# Altium project PDM-C.PrjPcb
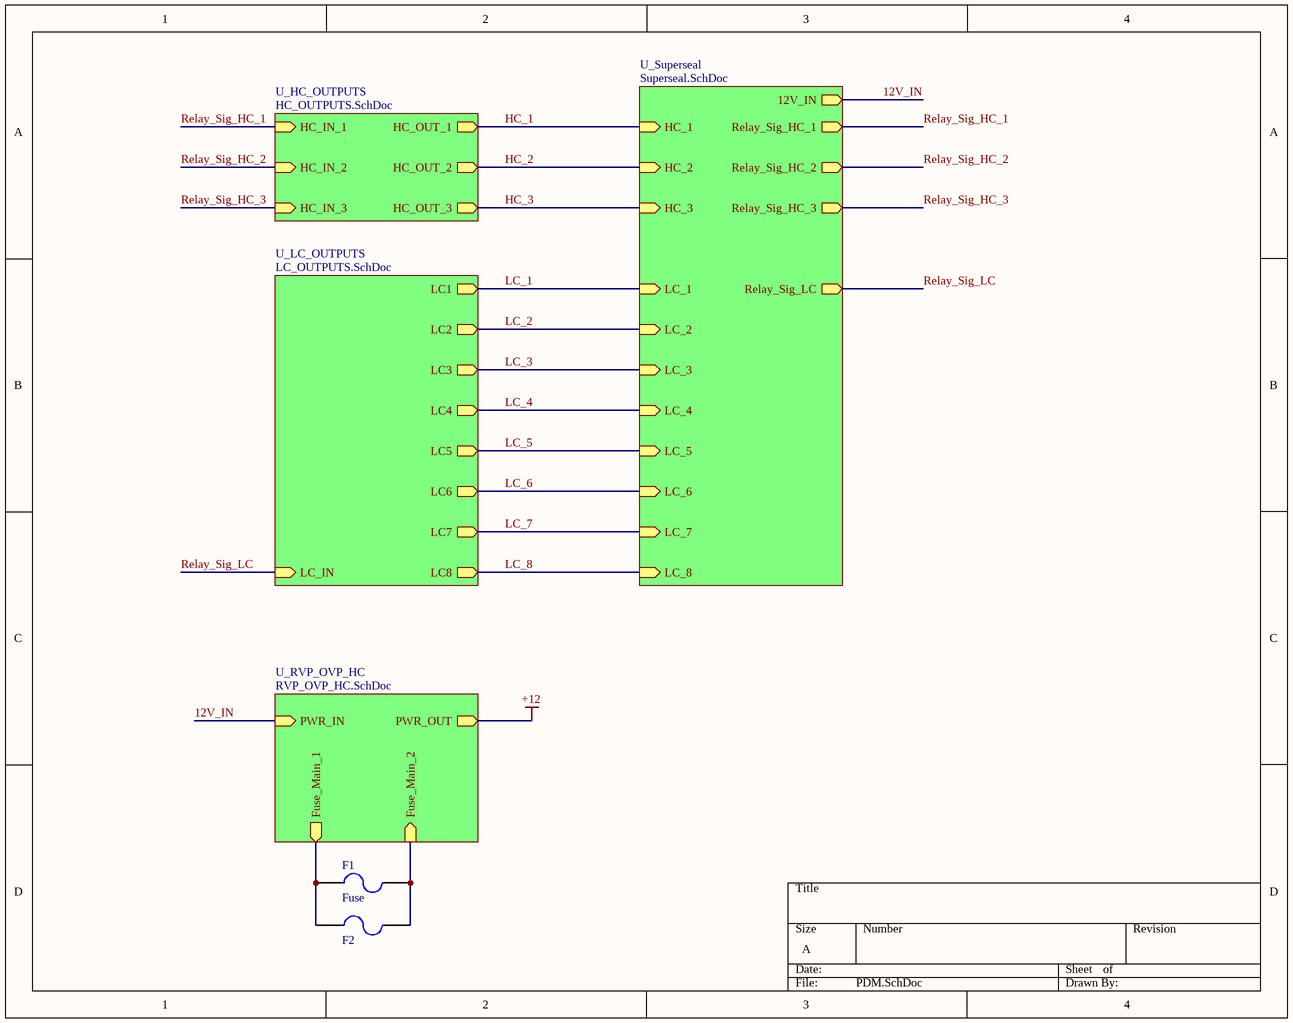
[diagram p0: PDM.SchDoc]
6 sheets, 98 parts. Net scope: hierarchical (ports join the sheet entries above them; power ports are global).
Board files: PDM-C_Board.PcbDoc, PDM-C_Rev2.PcbDoc
Sheets:
  PDM.SchDoc
    U_LC_OUTPUTS = LC_OUTPUTS.SchDoc
      U_Blown_Fuse_LED = Blown_Fuse_LED.SchDoc
      U_Relay = Relay.SchDoc
      U_Blown_Fuse_LED = Blown_Fuse_LED.SchDoc
      U_Blown_Fuse_LED = Blown_Fuse_LED.SchDoc
      U_Blown_Fuse_LED = Blown_Fuse_LED.SchDoc
      U_Blown_Fuse_LED = Blown_Fuse_LED.SchDoc
      U_Blown_Fuse_LED = Blown_Fuse_LED.SchDoc
      U_Blown_Fuse_LED = Blown_Fuse_LED.SchDoc
      U_Blown_Fuse_LED = Blown_Fuse_LED.SchDoc
    U_HC_OUTPUTS = HC_OUTPUTS.SchDoc
      U_Blown_Fuse_LED = Blown_Fuse_LED.SchDoc
      U_Relay = Relay.SchDoc
      U_Blown_Fuse_LED = Blown_Fuse_LED.SchDoc
      U_Relay = Relay.SchDoc
      U_Blown_Fuse_LED = Blown_Fuse_LED.SchDoc
      U_Relay = Relay.SchDoc
    U_Superseal = Superseal.SchDoc

## Sheet PDM.SchDoc
size A

### Parts
F1  Fuse  [3568-MiniFuseHolder]
F2  Fuse  [3568-MiniFuseHolder]  (value not drawn)

### Sub-sheets
U_HC_OUTPUTS = HC_OUTPUTS.SchDoc: HC_IN_1 (in), HC_OUT_1 (out), HC_IN_2 (in), HC_OUT_2 (out), HC_IN_3 (in), HC_OUT_3 (out)
U_LC_OUTPUTS = LC_OUTPUTS.SchDoc: LC8 (out), LC1 (out), LC2 (out), LC3 (out), LC4 (out), LC5 (out), LC6 (out), LC7 (out), LC_IN (in)
U_RVP_OVP_HC = RVP_OVP_HC.SchDoc (file not in this document): PWR_IN (in), PWR_OUT (out), Fuse_Main_1 (out), Fuse_Main_2 (in)
U_Superseal = Superseal.SchDoc: 12V_IN (out), Relay_Sig_LC (out), Relay_Sig_HC_1 (out), Relay_Sig_HC_2 (out), HC_1 (in), HC_2 (in), LC_1 (in), LC_2 (in), LC_3 (in), LC_4 (in), LC_5 (in), LC_6 (in), LC_7 (in), LC_8 (in), Relay_Sig_HC_3 (out), HC_3 (in)

### Nets
12V_IN: sheet U_RVP_OVP_HC/PWR_IN, sheet U_Superseal/12V_IN
HC_1: sheet U_HC_OUTPUTS/HC_OUT_1, sheet U_Superseal/HC_1
HC_2: sheet U_HC_OUTPUTS/HC_OUT_2, sheet U_Superseal/HC_2
HC_3: sheet U_HC_OUTPUTS/HC_OUT_3, sheet U_Superseal/HC_3
LC_1: sheet U_LC_OUTPUTS/LC1, sheet U_Superseal/LC_1
LC_2: sheet U_LC_OUTPUTS/LC2, sheet U_Superseal/LC_2
LC_3: sheet U_LC_OUTPUTS/LC3, sheet U_Superseal/LC_3
LC_4: sheet U_LC_OUTPUTS/LC4, sheet U_Superseal/LC_4
LC_5: sheet U_LC_OUTPUTS/LC5, sheet U_Superseal/LC_5
LC_6: sheet U_LC_OUTPUTS/LC6, sheet U_Superseal/LC_6
LC_7: sheet U_LC_OUTPUTS/LC7, sheet U_Superseal/LC_7
LC_8: sheet U_LC_OUTPUTS/LC8, sheet U_Superseal/LC_8
Relay_Sig_HC_1: sheet U_HC_OUTPUTS/HC_IN_1, sheet U_Superseal/Relay_Sig_HC_1
Relay_Sig_HC_2: sheet U_HC_OUTPUTS/HC_IN_2, sheet U_Superseal/Relay_Sig_HC_2
Relay_Sig_HC_3: sheet U_HC_OUTPUTS/HC_IN_3, sheet U_Superseal/Relay_Sig_HC_3
Relay_Sig_LC: sheet U_LC_OUTPUTS/LC_IN, sheet U_Superseal/Relay_Sig_LC
NetF1_1: F1.1 F2.1 ; sheet U_RVP_OVP_HC/Fuse_Main_1
NetF1_2: F1.2 F2.2 ; sheet U_RVP_OVP_HC/Fuse_Main_2

### Library data of the parts
F1 F2 = 3: Manufacturer_id: 1; idFuse: 3; Name: 3568 Mini Fuse Holder; Drawer_id: 1
  F2: Link: https://www.digikey.com/product-detail/en/keystone-electronics/3568/36-3568-ND/2137306

## Sheet LC_OUTPUTS.SchDoc
size A
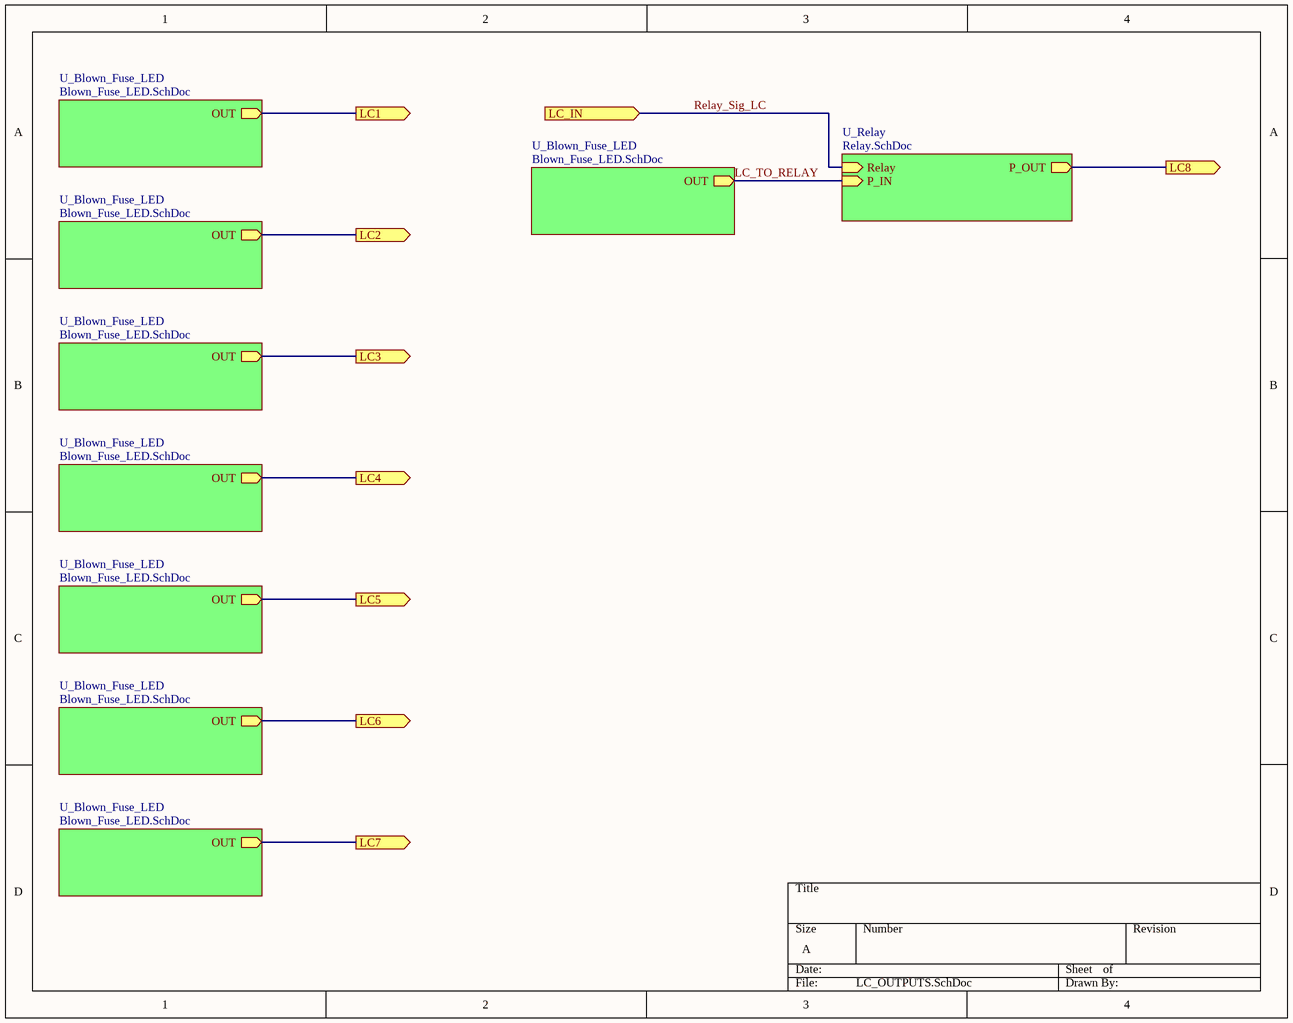
[diagram p1: LC_OUTPUTS.SchDoc]

### Sub-sheets
U_Blown_Fuse_LED = Blown_Fuse_LED.SchDoc: OUT (out)
U_Blown_Fuse_LED = Blown_Fuse_LED.SchDoc: OUT (out)
U_Blown_Fuse_LED = Blown_Fuse_LED.SchDoc: OUT (out)
U_Blown_Fuse_LED = Blown_Fuse_LED.SchDoc: OUT (out)
U_Blown_Fuse_LED = Blown_Fuse_LED.SchDoc: OUT (out)
U_Blown_Fuse_LED = Blown_Fuse_LED.SchDoc: OUT (out)
U_Blown_Fuse_LED = Blown_Fuse_LED.SchDoc: OUT (out)
U_Blown_Fuse_LED = Blown_Fuse_LED.SchDoc: OUT (out)
U_Relay = Relay.SchDoc: Relay (in), P_OUT (out), P_IN (in)

### Ports
LC1 (out), LC2 (out), LC3 (out), LC4 (out), LC5 (out), LC6 (out), LC7 (out), LC8 (out), LC_IN (in)

### Nets
LC_1: port LC1, sheet U_Blown_Fuse_LED/OUT
LC_2: port LC2, sheet U_Blown_Fuse_LED/OUT
LC_3: port LC3, sheet U_Blown_Fuse_LED/OUT
LC_4: port LC4, sheet U_Blown_Fuse_LED/OUT
LC_5: port LC5, sheet U_Blown_Fuse_LED/OUT
LC_6: port LC6, sheet U_Blown_Fuse_LED/OUT
LC_7: port LC7, sheet U_Blown_Fuse_LED/OUT
LC_8: port LC8, sheet U_Relay/P_OUT
LC_TO_RELAY: sheet U_Blown_Fuse_LED/OUT, sheet U_Relay/P_IN
Relay_Sig_LC: port LC_IN, sheet U_Relay/Relay

## Sheet Blown_Fuse_LED.SchDoc
size A
Used 11 times, as channels U_LC_OUTPUTS/U_Blown_Fuse_LED, U_LC_OUTPUTS/U_Blown_Fuse_LED, U_LC_OUTPUTS/U_Blown_Fuse_LED, U_LC_OUTPUTS/U_Blown_Fuse_LED, U_LC_OUTPUTS/U_Blown_Fuse_LED, U_LC_OUTPUTS/U_Blown_Fuse_LED, U_LC_OUTPUTS/U_Blown_Fuse_LED, U_LC_OUTPUTS/U_Blown_Fuse_LED, U_HC_OUTPUTS/U_Blown_Fuse_LED, U_HC_OUTPUTS/U_Blown_Fuse_LED, U_HC_OUTPUTS/U_Blown_Fuse_LED. Parts and nets are listed once, with the designators drawn on the sheet.
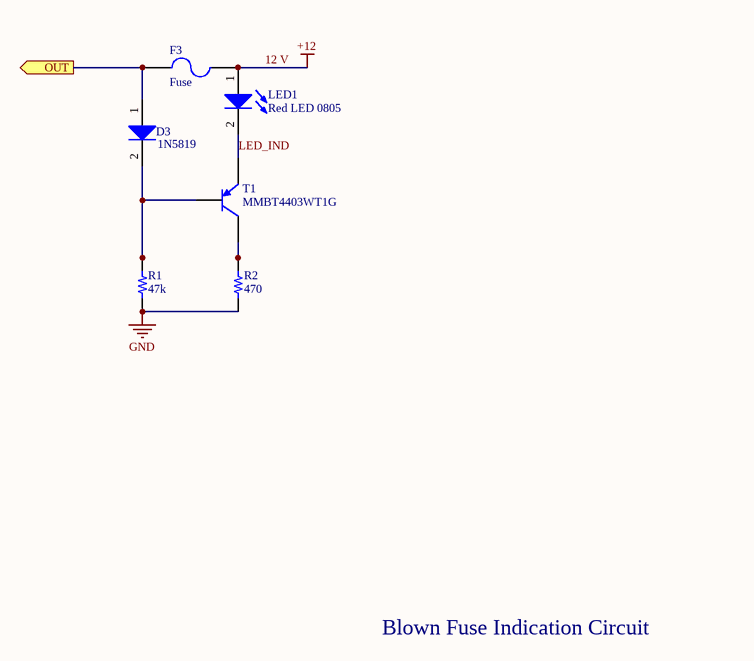
[diagram p2: Blown_Fuse_LED.SchDoc]

### Parts
D3  1N5819  [SOD123F]
F3  Fuse  [3568-MiniFuseHolder]
LED1  Red LED 0805  [0805_LED]
R1  value 47k  [RES 0805/2012]  (hidden comment: Resistor 47k 0805 1/10W 1%)
R2  value 470  [RES 0805/2012]  (hidden comment: Resistor 470 0805 1/10W 1%)
T1  MMBT4403WT1G  [SOT23-3]

### Ports
OUT (out)

### Nets
12 V: F3.2 LED1.1(A)  [also labelled +12]
GND: R1.2 R2.2
LED_IND: LED1.2(K) T1.2(E)
OUT: D3.1(A) F3.1 ; port OUT
NetD3_2: D3.2(K) R1.1 T1.1(B)
NetR2_1: R2.1 T1.3(C)

### Channels
U_LC_OUTPUTS/U_Blown_Fuse_LED: designators D3=D14 F3=F8 LED1=LED8 R1=R16 R2=R17 T1=T5; ports OUT=LC_TO_RELAY
U_LC_OUTPUTS/U_Blown_Fuse_LED: designators D3=D15 F3=F10 LED1=LED9 R1=R18 R2=R19 T1=T4; ports OUT=LC_1
U_LC_OUTPUTS/U_Blown_Fuse_LED: designators D3=D16 F3=F12 LED1=LED11 R1=R20 R2=R22 T1=T3; ports OUT=LC_2
U_LC_OUTPUTS/U_Blown_Fuse_LED: designators D3=D17 F3=F13 LED1=LED12 R1=R23 R2=R24 T1=T2; ports OUT=LC_3
U_LC_OUTPUTS/U_Blown_Fuse_LED: designators D3=D8 F3=F6 LED1=LED4 R1=R8 R2=R9 T1=T9; ports OUT=LC_4
U_LC_OUTPUTS/U_Blown_Fuse_LED: designators D3=D10 F3=F7 LED1=LED5 R1=R10 R2=R11 T1=T8; ports OUT=LC_5
U_LC_OUTPUTS/U_Blown_Fuse_LED: designators D3=D11 F3=F9 LED1=LED6 R1=R12 R2=R13 T1=T7; ports OUT=LC_6
U_LC_OUTPUTS/U_Blown_Fuse_LED: designators D3=D13 F3=F11 LED1=LED7 R1=R14 R2=R15 T1=T6; ports OUT=LC_7
U_HC_OUTPUTS/U_Blown_Fuse_LED: designators D3=D5 F3=F5 LED1=LED3 R1=R6 R2=R7 T1=T10; ports OUT=HC1_TO_RELAY
U_HC_OUTPUTS/U_Blown_Fuse_LED: designators D3=D1 F3=F3 LED1=LED1 R1=R1 R2=R2 T1=T12; ports OUT=HC2_TO_RELAY
U_HC_OUTPUTS/U_Blown_Fuse_LED: designators D3=D2 F3=F4 LED1=LED2 R1=R3 R2=R4 T1=T11; ports OUT=HC3_TO_RELAY

### Notes on the sheet
- Blown Fuse Indication Circuit

### Library data of the parts
D3 = 2: Diode Super Barrier 40V 1A Surface Mount SOD-123F; Manufacturer_id: 1; MfrPartNo: 1N5819HW1-7-F; idDiode: 2; Drawer_id: 1; Name: 1N5819; Value: 1A; Type: Super Barrier; Num_Circuits: 1; Ic: 1A; Power: 40V; Package: SOD-123; Link: https://www.digikey.com/product-detail/en/diodes-incorporated/1N5819HW1-7-F/1N5819HW1-7-FDITR-ND/5768523; ComponentLink1Description: Datasheet; ComponentLink1URL: https://www.diodes.com/assets/Datasheets/1N5819HW1.pdf; Supplier1: Digi-Key; Supplier1PartNo: 1N5819HW1-7-FDITR-ND
F3 = 3: as F1 on sheet PDM; Drawer_id: 1
LED1 = 1: idLED: 1; Name: LED_0805_RED; Vf: 0.7V; Manufacturer_id: 1; Drawer_id: 1; Value: Red; Package: 0805
R1 = 545: Manufacturer_id: 1; idResistor: 545; Name: Res_47k_0805_1/10W_1%; Created_By: Nick Mah; Supplier 1: Digi-Key; Drawer_id: 1; Tolerance: 1%; Power: 1/10W; Package: 0805; ComponentLink1Description: Datasheet; Created_Date: 2018-10-20
R2 = 497: Manufacturer_id: 1; idResistor: 497; Name: Res_470_0805_1/10W_1%; Created_By: Nick Mah; Supplier 1: Digi-Key; Drawer_id: 1; Tolerance: 1%; Power: 1/10W; Package: 0805; ComponentLink1Description: Datasheet; Created_Date: 2018-10-20
T1 = 3: Manufacturer_id: 1; idBJT: 3; Type: PNP; Ic: 600mA; Vce(Max): -40V; Created_By: Angel; Drawer_id: 1; Name: MMBT4403WT1G; Num_Circuits: 1; Package: SOT23-3; MfrPartNo: MMBT4403WT1G; Link: https://www.digikey.com/product-detail/en/on-semiconductor/MMBT4403WT1G/MMBT4403WT1GOSCT-ND/3487572

## Sheet Relay.SchDoc
size A
Used 4 times, as channels U_LC_OUTPUTS/U_Relay, U_HC_OUTPUTS/U_Relay, U_HC_OUTPUTS/U_Relay, U_HC_OUTPUTS/U_Relay. Parts and nets are listed once, with the designators drawn on the sheet.
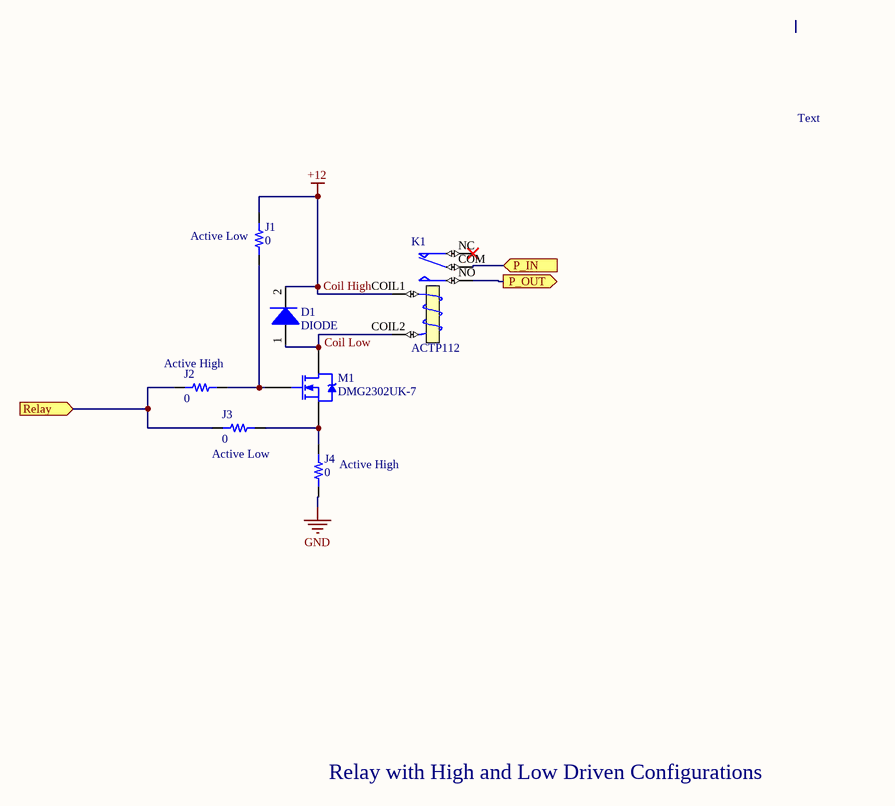
[diagram p3: Relay.SchDoc]

### Parts
D1  DIODE  [SOD123F]
J1  value 0  [RES 0603/1608]  (hidden comment: Resistor 1.0 0603 1/10W 10%)
J2  value 0  [RES 0603/1608]  (hidden comment: Resistor 1.0 0603 1/10W 10%)
J3  value 0  [RES 0603/1608]  (hidden comment: Resistor 1.0 0603 1/10W 10%)
J4  value 0  [RES 0603/1608]  (hidden comment: Resistor 1.0 0603 1/10W 10%)
K1  ACTP112  [ACTP112]
M1  DMG2302UK-7  [SOT23-3]

### Ports
P_IN (in), P_OUT (out), Relay (in)

### Nets
Coil High: D1.2(K) J1.2 K1.COIL1(T1)  [also labelled +12]
GND: J4.2
P_IN: K1.COM ; port P_IN
P_OUT: K1.NO ; port P_OUT
Relay: J2.2 J3.1 ; port Relay
NetD1_1: D1.1(A) K1.COIL2(T2) M1.3(D)
NetJ1_1: J1.1 J2.1 M1.1(G)
NetJ3_2: J3.2 J4.1 M1.2(S)

Not connected (* = marked no-connect by the designer): K1 NC*

### Channels
U_LC_OUTPUTS/U_Relay: designators D1=D12 J1=J3 J2=J1#1 J3=J4 J4=J2 K1=K4 M1=M1; ports P_IN=LC_TO_RELAY P_OUT=LC_8 Relay=Relay_Sig_LC
U_HC_OUTPUTS/U_Relay: designators D1=D9 J1=J9 J2=J5 J3=J10 J4=J6 K1=K3 M1=M2; ports P_IN=HC1_TO_RELAY P_OUT=HC_1 Relay=Relay_Sig_HC_1
U_HC_OUTPUTS/U_Relay: designators D1=D3 J1=J16 J2=J14 J3=J17 J4=J15 K1=K1 M1=M4; ports P_IN=HC2_TO_RELAY P_OUT=HC_2 Relay=Relay_Sig_HC_2
U_HC_OUTPUTS/U_Relay: designators D1=D6 J1=J8 J2=J13 J3=J7 J4=J11 K1=K2 M1=M3; ports P_IN=HC3_TO_RELAY P_OUT=HC_3 Relay=Relay_Sig_HC_3

### Notes on the sheet
- Text
- (near J1) Active Low
- (near J2) Active High
- (near J3) Active Low
- (near J4) Active High
- Relay with High and Low Driven Configurations
- Labels drawn without touching a wire or pin: Coil Low

### Library data of the parts
D1 = 2: Diode Super Barrier 40V 1A Surface Mount SOD-123F; Manufacturer_id: 1; MfrPartNo: 1N5819HW1-7-F; idDiode: 2; Name: 1N5819; Drawer_id: 1; Value: 1A; Type: Super Barrier; Num_Circuits: 1; Ic: 1A; Power: 40V; Package: SOD-123; Link: https://www.digikey.com/product-detail/en/diodes-incorporated/1N5819HW1-7-F/1N5819HW1-7-FDITR-ND/5768523; ComponentLink1Description: Datasheet; ComponentLink1URL: https://www.diodes.com/assets/Datasheets/1N5819HW1.pdf; Supplier1: Digi-Key; Supplier1PartNo: 1N5819HW1-7-FDITR-ND
J1-J4 = 2269: Manufacturer_id: 1; idResistor: 2269; Name: Res_1.0_0603_1/10W_10%; Created_By: Nick Mah; Supplier 1: Digi-Key; Drawer_id: 1; Tolerance: 10%; Power: 1/10W; Package: 0603; ComponentLink1Description: Datasheet; Created_Date: 2018-10-20
K1 = 3: Manufacturer_id: 1; idRelay: 3; Coil_Voltage: 12V; Published: 8-Jun-2000; LatestRevisionDate: 17-Jul-2002; LatestRevisionNote: Re-released for DXP Platform.; PackageReference: MODULE5B; Publisher: Altium Limited; Drawer_id: 1; Name: ACTP112
M1 = 6: MOSFET N-CHANNEL 30V 5A SOT23; Manufacturer_id: 1; idFETs: 6; Value: N_Channel; Vdss: 20V; Id: 2.8A; Rds_On: 90mOhm; Vgs(typ): 800mV; Vgs(Max): 1V; Created_By: Angel; MfrPartNo: DMG2302UK-7; Drawer_id: 1; Name: DMG2302UK-7; Num_Circuits: 1; Package: SOT-23; Link: https://www.digikey.com/product-detail/en/diodes-incorporated/DMG2302UK-7/DMG2302UK-7DICT-ND/6010163; Supplier1: Digi-Key

## Sheet HC_OUTPUTS.SchDoc
size A
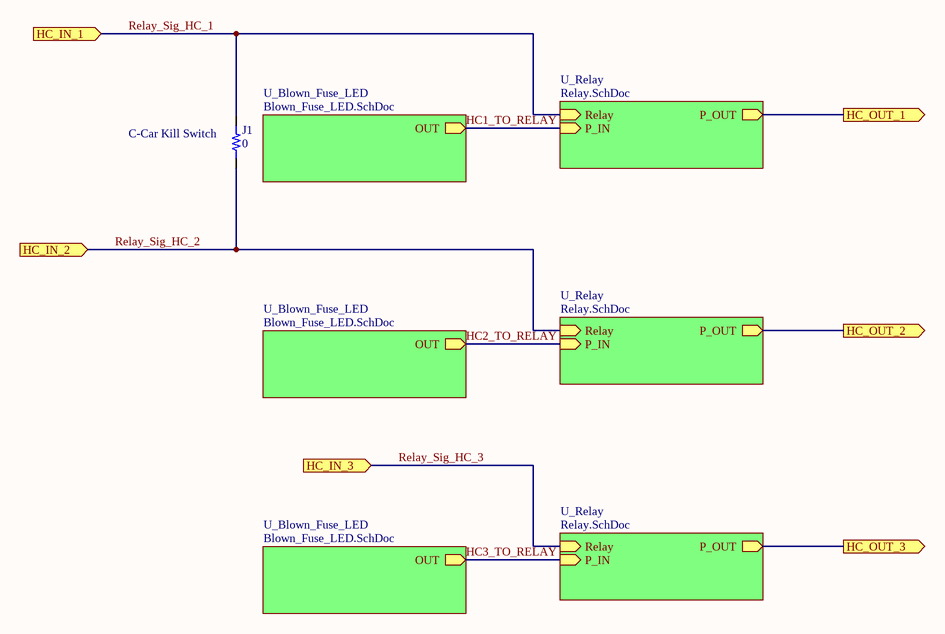
[diagram p4: HC_OUTPUTS.SchDoc]

### Parts
(Parts that share a designator on the sheet are numbered #1, #2 ... from top to bottom, then left to right.)
J1#2  value 0  [RES 0603/1608]  (hidden comment: Resistor 1.0 0603 1/10W 10%)

### Sub-sheets
U_Blown_Fuse_LED = Blown_Fuse_LED.SchDoc: OUT (out)
U_Blown_Fuse_LED = Blown_Fuse_LED.SchDoc: OUT (out)
U_Blown_Fuse_LED = Blown_Fuse_LED.SchDoc: OUT (out)
U_Relay = Relay.SchDoc: Relay (in), P_OUT (out), P_IN (in)
U_Relay = Relay.SchDoc: Relay (in), P_OUT (out), P_IN (in)
U_Relay = Relay.SchDoc: Relay (in), P_OUT (out), P_IN (in)

### Ports
HC_IN_1 (in), HC_IN_2 (in), HC_IN_3 (in), HC_OUT_1 (out), HC_OUT_2 (out), HC_OUT_3 (out)

### Nets
HC1_TO_RELAY: sheet U_Blown_Fuse_LED/OUT, sheet U_Relay/P_IN
HC2_TO_RELAY: sheet U_Blown_Fuse_LED/OUT, sheet U_Relay/P_IN
HC3_TO_RELAY: sheet U_Blown_Fuse_LED/OUT, sheet U_Relay/P_IN
HC_1: port HC_OUT_1, sheet U_Relay/P_OUT
HC_2: port HC_OUT_2, sheet U_Relay/P_OUT
HC_3: port HC_OUT_3, sheet U_Relay/P_OUT
Relay_Sig_HC_1: J1#2.1 ; port HC_IN_1, sheet U_Relay/Relay
Relay_Sig_HC_2: J1#2.2 ; port HC_IN_2, sheet U_Relay/Relay
Relay_Sig_HC_3: port HC_IN_3, sheet U_Relay/Relay

### Notes on the sheet
- (near J1#2) C-Car Kill Switch

### Library data of the parts
J1#2 = 2269: as J1 on sheet Relay; Supplier 1: Digi-Key; Drawer_id: 1; Tolerance: 10%; Power: 1/10W; Package: 0603; ComponentLink1Description: Datasheet; Created_Date: 2018-10-20

## Sheet Superseal.SchDoc
size A
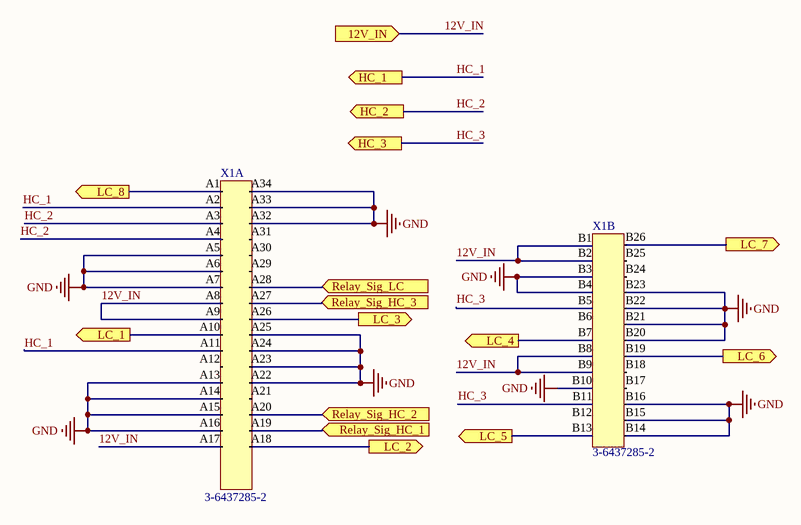
[diagram p5: Superseal.SchDoc]

### Parts
X1  3-6437285-2  [SUPERSEAL 60POS 90Deg]  (parts A,B of 2)

### Ports
12V_IN (in), HC_1 (out), HC_2 (out), HC_3 (out), LC_1 (out), LC_2 (out), LC_3 (out), LC_4 (out), LC_5 (out), LC_6 (out), LC_7 (out), LC_8 (out), Relay_Sig_HC_1 (in), Relay_Sig_HC_2 (in), Relay_Sig_HC_3 (in), Relay_Sig_LC (in)

### Nets
GND: X1.A5 X1.A6 X1.A7 X1.A13 X1.A14 X1.A15 X1.A16 X1.A22 X1.A23 X1.A24 X1.A25 X1.A32 X1.A33 X1.A34 X1.B3 X1.B4 X1.B10 X1.B14 X1.B15 X1.B16 X1.B20 X1.B21 X1.B22 X1.B23
12V_IN: X1.A8 X1.A9 X1.A17 X1.B1 X1.B2 X1.B8 X1.B9 ; port 12V_IN
HC_1: X1.A2 X1.A11 ; port HC_1
HC_2: X1.A3 X1.A4 ; port HC_2
HC_3: X1.B5 X1.B11 ; port HC_3
LC_1: X1.A10 ; port LC_1
LC_2: X1.A18 ; port LC_2
LC_3: X1.A26 ; port LC_3
LC_4: X1.B7 ; port LC_4
LC_5: X1.B13 ; port LC_5
LC_6: X1.B19 ; port LC_6
LC_7: X1.B26 ; port LC_7
LC_8: X1.A1 ; port LC_8
Relay_Sig_HC_1: X1.A19 ; port Relay_Sig_HC_1
Relay_Sig_HC_2: X1.A20 ; port Relay_Sig_HC_2
Relay_Sig_HC_3: X1.A27 ; port Relay_Sig_HC_3
Relay_Sig_LC: X1.A28 ; port Relay_Sig_LC

Not connected (* = marked no-connect by the designer): X1 A12 A21 A29 A30 A31 B6 B12 B17 B18 B24 B25

### Library data of the parts
X1 = 3: 90 Degree; Manufacturer_id: 1; idConn: 3; Name: AMP Superseal 60POS 90Deg; Value: CONN; Num_Contacts: 60; Num_Rows: 4; Pitch: 3 mm; MfrPartNo: 3-6437285-2; Drawer_id: 1; Link: https://www.te.com/usa-en/product-3-6437285-2.html; ComponentLink1Description: Datasheet

## Nets that join several sheets
12 V: U_LC_OUTPUTS/U_Blown_Fuse_LED (F8.2 LED8.1), U_LC_OUTPUTS/U_Relay (D12.2 J3.2 K4.COIL1), U_LC_OUTPUTS/U_Blown_Fuse_LED (F10.2 LED9.1), U_LC_OUTPUTS/U_Blown_Fuse_LED (F12.2 LED11.1), U_LC_OUTPUTS/U_Blown_Fuse_LED (F13.2 LED12.1), U_LC_OUTPUTS/U_Blown_Fuse_LED (F6.2 LED4.1), U_LC_OUTPUTS/U_Blown_Fuse_LED (F7.2 LED5.1), U_LC_OUTPUTS/U_Blown_Fuse_LED (F9.2 LED6.1), U_LC_OUTPUTS/U_Blown_Fuse_LED (F11.2 LED7.1), U_HC_OUTPUTS/U_Blown_Fuse_LED (F5.2 LED3.1), U_HC_OUTPUTS/U_Relay (D9.2 J9.2 K3.COIL1), U_HC_OUTPUTS/U_Blown_Fuse_LED (F3.2 LED1.1), U_HC_OUTPUTS/U_Relay (D3.2 J16.2 K1.COIL1), U_HC_OUTPUTS/U_Blown_Fuse_LED (F4.2 LED2.1), U_HC_OUTPUTS/U_Relay (D6.2 J8.2 K2.COIL1)
GND: U_LC_OUTPUTS/U_Blown_Fuse_LED (R16.2 R17.2), U_LC_OUTPUTS/U_Relay (J2.2), U_LC_OUTPUTS/U_Blown_Fuse_LED (R18.2 R19.2), U_LC_OUTPUTS/U_Blown_Fuse_LED (R20.2 R22.2), U_LC_OUTPUTS/U_Blown_Fuse_LED (R23.2 R24.2), U_LC_OUTPUTS/U_Blown_Fuse_LED (R8.2 R9.2), U_LC_OUTPUTS/U_Blown_Fuse_LED (R10.2 R11.2), U_LC_OUTPUTS/U_Blown_Fuse_LED (R12.2 R13.2), U_LC_OUTPUTS/U_Blown_Fuse_LED (R14.2 R15.2), U_HC_OUTPUTS/U_Blown_Fuse_LED (R6.2 R7.2), U_HC_OUTPUTS/U_Relay (J6.2), U_HC_OUTPUTS/U_Blown_Fuse_LED (R1.2 R2.2), U_HC_OUTPUTS/U_Relay (J15.2), U_HC_OUTPUTS/U_Blown_Fuse_LED (R3.2 R4.2), U_HC_OUTPUTS/U_Relay (J11.2), Superseal (24 pins)
HC1_TO_RELAY: U_HC_OUTPUTS/U_Blown_Fuse_LED (D5.1 F5.1), U_HC_OUTPUTS/U_Relay (K3.COM)
HC2_TO_RELAY: U_HC_OUTPUTS/U_Blown_Fuse_LED (D1.1 F3.1), U_HC_OUTPUTS/U_Relay (K1.COM)
HC3_TO_RELAY: U_HC_OUTPUTS/U_Blown_Fuse_LED (D2.1 F4.1), U_HC_OUTPUTS/U_Relay (K2.COM)
HC_1: U_HC_OUTPUTS/U_Relay (K3.NO), Superseal (X1.A2 X1.A11)
HC_2: U_HC_OUTPUTS/U_Relay (K1.NO), Superseal (X1.A3 X1.A4)
HC_3: U_HC_OUTPUTS/U_Relay (K2.NO), Superseal (X1.B5 X1.B11)
LC_1: U_LC_OUTPUTS/U_Blown_Fuse_LED (D15.1 F10.1), Superseal (X1.A10)
LC_2: U_LC_OUTPUTS/U_Blown_Fuse_LED (D16.1 F12.1), Superseal (X1.A18)
LC_3: U_LC_OUTPUTS/U_Blown_Fuse_LED (D17.1 F13.1), Superseal (X1.A26)
LC_4: U_LC_OUTPUTS/U_Blown_Fuse_LED (D8.1 F6.1), Superseal (X1.B7)
LC_5: U_LC_OUTPUTS/U_Blown_Fuse_LED (D10.1 F7.1), Superseal (X1.B13)
LC_6: U_LC_OUTPUTS/U_Blown_Fuse_LED (D11.1 F9.1), Superseal (X1.B19)
LC_7: U_LC_OUTPUTS/U_Blown_Fuse_LED (D13.1 F11.1), Superseal (X1.B26)
LC_8: U_LC_OUTPUTS/U_Relay (K4.NO), Superseal (X1.A1)
LC_TO_RELAY: U_LC_OUTPUTS/U_Blown_Fuse_LED (D14.1 F8.1), U_LC_OUTPUTS/U_Relay (K4.COM)
Relay_Sig_HC_1: HC_OUTPUTS (J1#2.1), U_HC_OUTPUTS/U_Relay (J5.2 J10.1), Superseal (X1.A19)
Relay_Sig_HC_2: HC_OUTPUTS (J1#2.2), U_HC_OUTPUTS/U_Relay (J14.2 J17.1), Superseal (X1.A20)
Relay_Sig_HC_3: U_HC_OUTPUTS/U_Relay (J7.1 J13.2), Superseal (X1.A27)
Relay_Sig_LC: U_LC_OUTPUTS/U_Relay (J1#1.2 J4.1), Superseal (X1.A28)